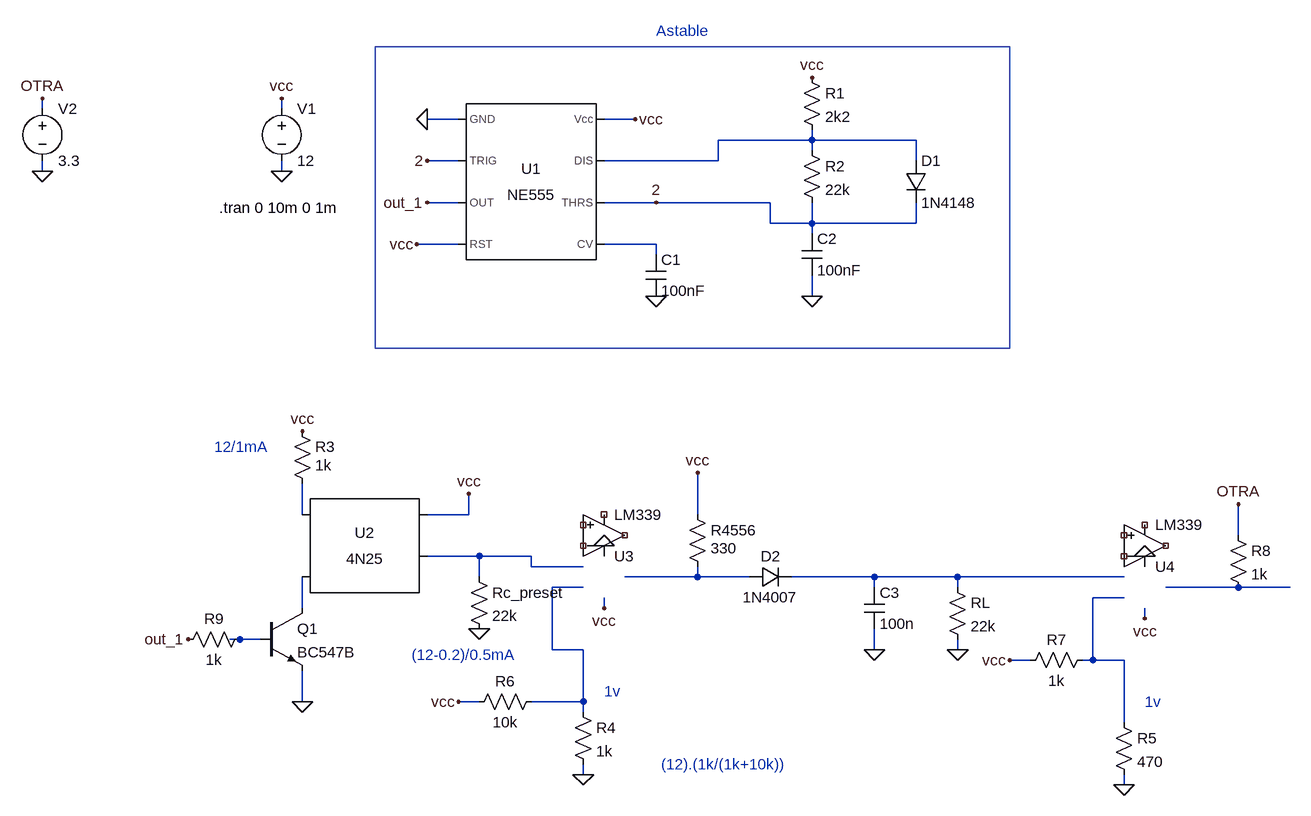
[diagram p0: schematic barrera pulsante.asc]
barrera pulsante.asc, the LTspice schematic file:
Version 4
SHEET 1 3100 680
WIRE 800 -640 800 -656
WIRE 1168 -640 1168 -656
WIRE 1440 -624 1392 -624
WIRE 1712 -624 1664 -624
WIRE 1984 -592 1984 -608
WIRE 1984 -592 1840 -592
WIRE 2144 -592 1984 -592
WIRE 1984 -576 1984 -592
WIRE 1440 -560 1392 -560
WIRE 1840 -560 1840 -592
WIRE 1840 -560 1664 -560
WIRE 2144 -560 2144 -592
WIRE 800 -544 800 -560
WIRE 1168 -544 1168 -560
WIRE 1440 -496 1392 -496
WIRE 1744 -496 1664 -496
WIRE 1920 -496 1744 -496
WIRE 1920 -464 1920 -496
WIRE 1984 -464 1984 -496
WIRE 1984 -464 1920 -464
WIRE 2144 -464 2144 -496
WIRE 2144 -464 1984 -464
WIRE 1984 -448 1984 -464
WIRE 1440 -432 1376 -432
WIRE 1744 -432 1664 -432
WIRE 1744 -416 1744 -432
WIRE 1984 -352 1984 -384
WIRE 1200 -16 1200 -64
WIRE 1456 -16 1456 -48
WIRE 1456 -16 1392 -16
WIRE 1808 -16 1808 -80
WIRE 2640 16 2640 -32
WIRE 1472 48 1392 48
WIRE 1552 48 1472 48
WIRE 1664 48 1664 32
WIRE 1552 64 1552 48
WIRE 1632 64 1552 64
WIRE 2496 64 2496 48
WIRE 1472 80 1472 48
WIRE 1808 80 1808 64
WIRE 1808 80 1696 80
WIRE 1888 80 1808 80
WIRE 2080 80 1952 80
WIRE 2208 80 2080 80
WIRE 2464 80 2208 80
WIRE 1632 96 1584 96
WIRE 2080 96 2080 80
WIRE 2208 96 2208 80
WIRE 2640 96 2528 96
WIRE 2720 96 2640 96
WIRE 2464 112 2416 112
WIRE 1200 128 1200 80
WIRE 1664 128 1664 112
WIRE 2496 144 2496 128
WIRE 1104 176 1088 176
WIRE 1136 176 1104 176
WIRE 1584 192 1584 96
WIRE 1632 192 1584 192
WIRE 2080 192 2080 160
WIRE 2208 192 2208 176
WIRE 2320 208 2288 208
WIRE 2416 208 2416 112
WIRE 2416 208 2400 208
WIRE 2464 208 2416 208
WIRE 1200 272 1200 224
WIRE 1472 272 1440 272
WIRE 1632 272 1632 192
WIRE 1632 272 1552 272
WIRE 1632 288 1632 272
WIRE 2464 304 2464 208
WIRE 1632 384 1632 368
WIRE 2464 400 2464 384
FLAG 1392 -624 0
FLAG 1712 -624 vcc
FLAG 1376 -432 vcc
FLAG 1744 -496 2
FLAG 1392 -560 2
FLAG 1744 -352 0
FLAG 1984 -352 0
FLAG 1984 -688 vcc
FLAG 1168 -656 vcc
FLAG 1168 -544 0
FLAG 1392 -496 out_1
FLAG 1200 272 0
FLAG 1024 176 out_1
FLAG 1200 -144 vcc
FLAG 1456 -48 vcc
FLAG 1808 -80 vcc
FLAG 2080 192 0
FLAG 2208 192 0
FLAG 1632 384 0
FLAG 1664 128 vcc
FLAG 1664 32 0
FLAG 1472 160 0
FLAG 1440 272 vcc
FLAG 2464 400 0
FLAG 2496 144 vcc
FLAG 2496 48 0
FLAG 2288 208 vcc
FLAG 800 -656 OTRA
FLAG 800 -544 0
FLAG 2640 -32 OTRA
SYMBOL Misc\\NE555 1552 -528 R0
SYMATTR InstName U1
SYMBOL cap 1728 -416 R0
SYMATTR InstName C1
SYMATTR Value 100nF
SYMBOL res 1968 -704 R0
SYMATTR InstName R1
SYMATTR Value 2k2
SYMBOL res 1968 -592 R0
SYMATTR InstName R2
SYMATTR Value 22k
SYMBOL cap 1968 -448 R0
SYMATTR InstName C2
SYMATTR Value 100nF
SYMBOL voltage 1168 -656 R0
SYMATTR InstName V1
SYMATTR Value 12
SYMBOL diode 2128 -560 R0
SYMATTR InstName D1
SYMATTR Value 1N4148
SYMBOL npn 1136 128 R0
SYMATTR InstName Q1
SYMATTR Value BC547B
SYMBOL Optos\\4N25 1296 48 R0
SYMATTR InstName U2
SYMBOL res 1184 -160 R0
WINDOW 3 36 68 Left 2
SYMATTR Value 1k
SYMATTR InstName R3
SYMBOL res 1792 -32 R0
WINDOW 3 36 68 Left 2
SYMATTR Value 330
SYMATTR InstName R4556
SYMBOL diode 1888 96 R270
WINDOW 0 32 32 VTop 2
WINDOW 3 0 32 VBottom 2
SYMATTR InstName D2
SYMATTR Value 1N4007
SYMBOL cap 2064 96 R0
SYMATTR InstName C3
SYMATTR Value 100n
SYMBOL res 2192 80 R0
SYMATTR InstName RL
SYMATTR Value 22k
SYMBOL Comparators\\LM339 1664 80 M180
SYMATTR InstName U3
SYMBOL res 1616 272 R0
SYMATTR InstName R4
SYMATTR Value 1k
SYMBOL res 1456 64 R0
SYMATTR InstName Rc_preset
SYMATTR Value 22k
SYMBOL res 1568 256 R90
WINDOW 0 0 56 VBottom 2
WINDOW 3 32 56 VTop 2
SYMATTR InstName R6
SYMATTR Value 10k
SYMBOL Comparators\\LM339 2496 96 M180
SYMATTR InstName U4
SYMBOL res 2448 288 R0
SYMATTR InstName R5
SYMATTR Value 470
SYMBOL res 2416 192 R90
WINDOW 0 0 56 VBottom 2
WINDOW 3 32 56 VTop 2
SYMATTR InstName R7
SYMATTR Value 1k
SYMBOL res 2624 0 R0
SYMATTR InstName R8
SYMATTR Value 1k
SYMBOL res 1120 160 R90
WINDOW 0 0 56 VBottom 2
WINDOW 3 32 56 VTop 2
SYMATTR InstName R9
SYMATTR Value 1k
SYMBOL voltage 800 -656 R0
SYMATTR InstName V2
SYMATTR Value 3.3
TEXT 1072 -488 Left 2 !.tran 0 10m 0 1m
TEXT 1744 -760 Left 2 ;Astable
TEXT 1368 200 Left 2 ;(12-0.2)/0.5mA
TEXT 1064 -120 Left 2 ;12/1mA
TEXT 1752 368 Left 2 ;(12).(1k/(1k+10k))
TEXT 1664 256 Left 2 ;1v
TEXT 2496 272 Left 2 ;1v
RECTANGLE Normal 1312 -736 2288 -272

The netlist it stands for:
* barrera pulsante.asc
XU1 0 2 out_1 vcc N002 2 N001 vcc NE555  ; pins GND TRIG OUT RST CV THRS DIS Vcc
C1 N002 0 100nF
R1 vcc N001 2k2
R2 N001 2 22k
C2 2 0 100nF
V1 vcc 0 12
D1 N001 2 1N4148
Q1 N010 N011 0 0 BC547B
XU2 N003 N010 vcc N004 NC_01 4N25
R3 vcc N003 1k
R4556 vcc N005 330
D2 N005 N006 1N4007
C3 N006 0 100n
RL N006 0 22k
XU3 NC_02 NC_03 0 NC_04 NC_05 LM339  ; pins In+ In- V+ V- OUT
R4 N007 0 1k
Rc_preset N004 0 22k
R6 N007 vcc 10k
XU4 NC_06 NC_07 0 NC_08 NC_09 LM339  ; pins In+ In- V+ V- OUT
R5 N009 0 470
R7 N009 vcc 1k
R8 OTRA N008 1k
R9 N011 out_1 1k
V2 OTRA 0 3.3
.model D D
.lib standard.dio
.model NPN NPN
.model PNP PNP
.lib standard.bjt
.tran 0 10m 0 1m
* Astable
* (12-0.2)/0.5mA
* 12/1mA
* (12).(1k/(1k+10k))
* 1v
* 1v
.lib NE555.sub
.lib 4N25.sub
.lib LM339.sub
.backanno
.end